# Altium project QFP100_05_SOCKET.PrjPcb
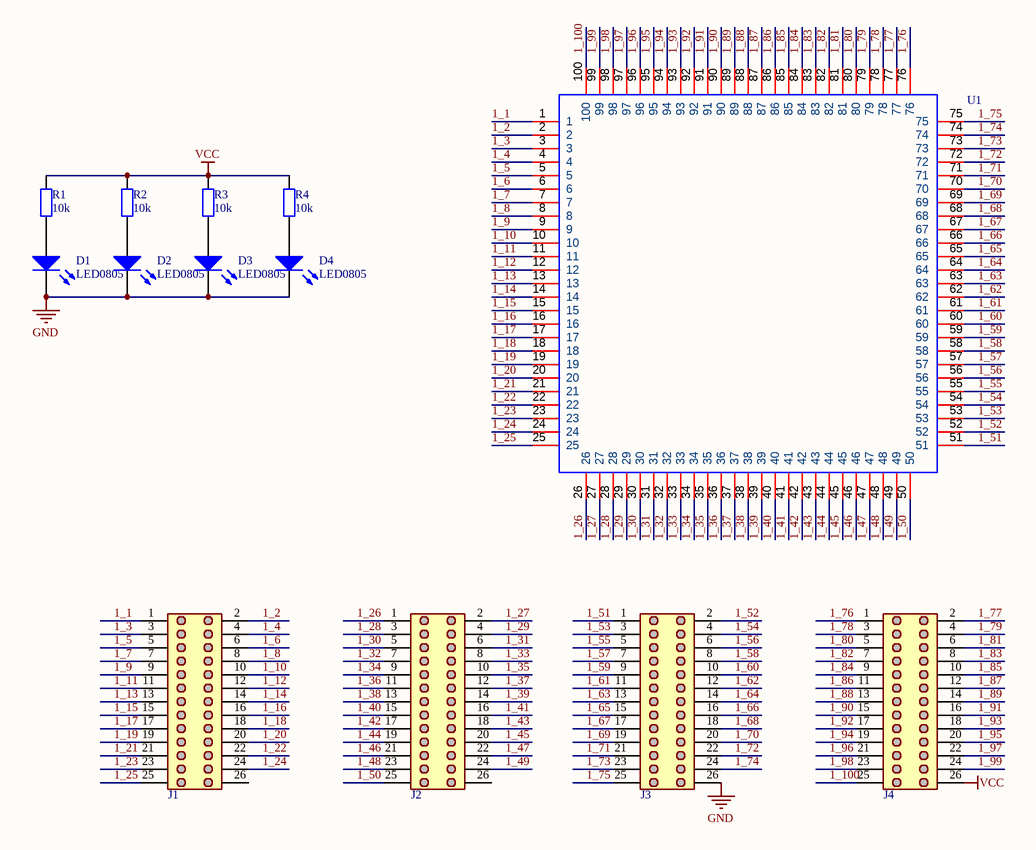
[diagram p0: Sheet1.SchDoc]
1 sheet, 13 parts. Net scope: global (net labels, ports and power ports of the same name join across sheets).
Board file: PCB1.PcbDoc

## Sheet Sheet1.SchDoc
size A3

### Parts
D1  LED0805  [L0805RED]
D2  LED0805  [L0805RED]
D3  LED0805  [L0805RED]
D4  LED0805  [L0805RED]
J1  Header 13x2 TH Pitch 2.54mm  [Header 13x2 TH Pitch 2.54mm]  (value not drawn)
J2  Header 13x2 TH Pitch 2.54mm  [Header 13x2 TH Pitch 2.54mm]  (value not drawn)
J3  Header 13x2 TH Pitch 2.54mm  [Header 13x2 TH Pitch 2.54mm]  (value not drawn)
J4  Header 13x2 TH Pitch 2.54mm  [Header 13x2 TH Pitch 2.54mm]  (value not drawn)
R1  10k  [R0805]
R2  10k  [R0805]
R3  10k  [R0805]
R4  10k  [R0805]
U1  QFP100-0.5 SOCKET  [QFP100-0.5 SOCKET]  (value not drawn)

### Nets
GND: D1.2(K) D2.2(K) D3.2(K) D4.2(K) J3.26
VCC: J4.26 R1.2 R2.2 R3.2 R4.2
1_1: J1.1 U1.1
1_2: J1.2 U1.2
1_3: J1.3 U1.3
1_4: J1.4 U1.4
1_5: J1.5 U1.5
1_6: J1.6 U1.6
1_7: J1.7 U1.7
1_8: J1.8 U1.8
1_9: J1.9 U1.9
1_10: J1.10 U1.10
1_11: J1.11 U1.11
1_12: J1.12 U1.12
1_13: J1.13 U1.13
1_14: J1.14 U1.14
1_15: J1.15 U1.15
1_16: J1.16 U1.16
1_17: J1.17 U1.17
1_18: J1.18 U1.18
1_19: J1.19 U1.19
1_20: J1.20 U1.20
1_21: J1.21 U1.21
1_22: J1.22 U1.22
1_23: J1.23 U1.23
1_24: J1.24 U1.24
1_25: J1.25 U1.25
1_26: J2.1 U1.26
1_27: J2.2 U1.27
1_28: J2.3 U1.28
1_29: J2.4 U1.29
1_30: J2.5 U1.30
1_31: J2.6 U1.31
1_32: J2.7 U1.32
1_33: J2.8 U1.33
1_34: J2.9 U1.34
1_35: J2.10 U1.35
1_36: J2.11 U1.36
1_37: J2.12 U1.37
1_38: J2.13 U1.38
1_39: J2.14 U1.39
1_40: J2.15 U1.40
1_41: J2.16 U1.41
1_42: J2.17 U1.42
1_43: J2.18 U1.43
1_44: J2.19 U1.44
1_45: J2.20 U1.45
1_46: J2.21 U1.46
1_47: J2.22 U1.47
1_48: J2.23 U1.48
1_49: J2.24 U1.49
1_50: J2.25 U1.50
1_51: J3.1 U1.51
1_52: J3.2 U1.52
1_53: J3.3 U1.53
1_54: J3.4 U1.54
1_55: J3.5 U1.55
1_56: J3.6 U1.56
1_57: J3.7 U1.57
1_58: J3.8 U1.58
1_59: J3.9 U1.59
1_60: J3.10 U1.60
1_61: J3.11 U1.61
1_62: J3.12 U1.62
1_63: J3.13 U1.63
1_64: J3.14 U1.64
1_65: J3.15 U1.65
1_66: J3.16 U1.66
1_67: J3.17 U1.67
1_68: J3.18 U1.68
1_69: J3.19 U1.69
1_70: J3.20 U1.70
1_71: J3.21 U1.71
1_72: J3.22 U1.72
1_73: J3.23 U1.73
1_74: J3.24 U1.74
1_75: J3.25 U1.75
1_76: J4.1 U1.76
1_77: J4.2 U1.77
1_78: J4.3 U1.78
1_79: J4.4 U1.79
1_80: J4.5 U1.80
1_81: J4.6 U1.81
1_82: J4.7 U1.82
1_83: J4.8 U1.83
1_84: J4.9 U1.84
1_85: J4.10 U1.85
1_86: J4.11 U1.86
1_87: J4.12 U1.87
1_88: J4.13 U1.88
1_89: J4.14 U1.89
1_90: J4.15 U1.90
1_91: J4.16 U1.91
1_92: J4.17 U1.92
1_93: J4.18 U1.93
1_94: J4.19 U1.94
1_95: J4.20 U1.95
1_96: J4.21 U1.96
1_97: J4.22 U1.97
1_98: J4.23 U1.98
1_99: J4.24 U1.99
1_100: J4.25 U1.100
NetD1_1: D1.1(A) R1.1
NetD2_1: D2.1(A) R2.1
NetD3_1: D3.1(A) R3.1
NetD4_1: D4.1(A) R4.1

Not connected (* = marked no-connect by the designer): J1 26; J2 26

### Library data of the parts
R1-R4 = Resistor